# Altium schematic sheet SH1 - POWER.SchDoc: Power
size B; CheckedBy: Lance Bantoto; Engineer: Wolfgang Windholtz; Organization: UW Robotics; Address1: 200 University Avenue; Address2: Waterloo; Address3: Ontario; Address4: Canada N2L 3G6; DocumentNumber: 2; Revision: 2; SheetNumber: 1; SheetTotal: 5
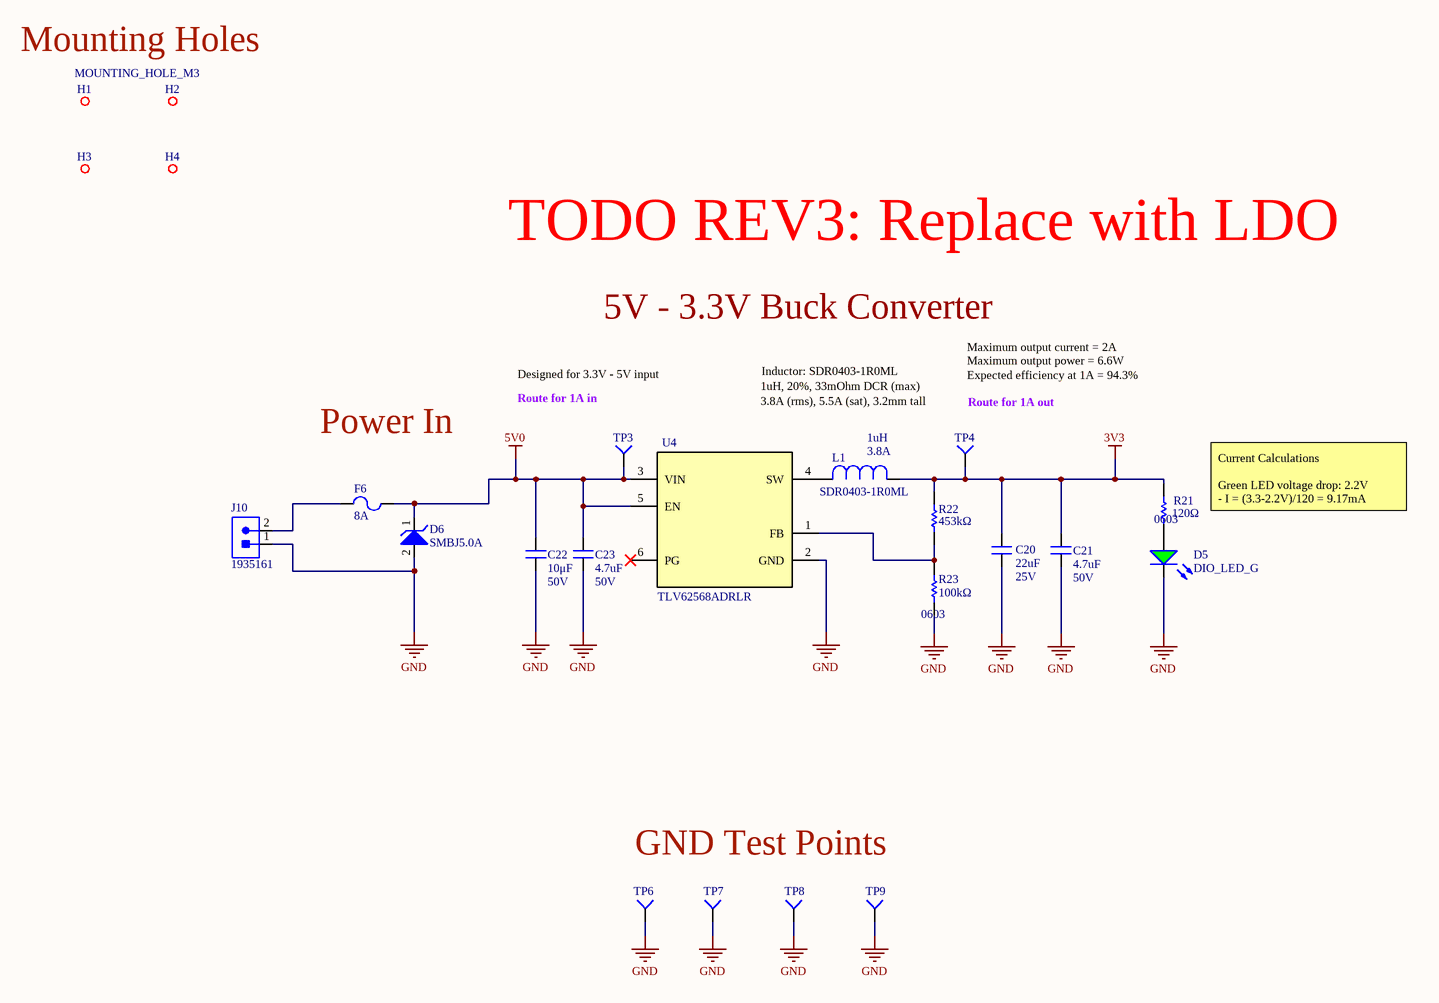
[diagram p0: SH1 - POWER.SchDoc]

## Parts
C20  Voltage: 25V  Capacitance: 22uF  [CAPC3225X270N]  (hidden comment: CAP_22uF_25V_1210)
C21  Capacitance: 4.7uF  Voltage: 50V  [CAP1206]  (hidden comment: CAP_4.7uF_50V_1206)
C22  value 10μF  Voltage Rating: 50V  [CAP1206]  (hidden comment: CAP_10uF_50V_1206)
C23  Capacitance: 4.7uF  Voltage: 50V  [CAP1206]  (hidden comment: CAP_4.7uF_50V_1206)
D5  DIO_LED_G  [LED_0805_GREEN]
D6  TVS_DIODE_UNIDIR_5V  [SMBJ5.0A]  (value not drawn)
F6  Current Rating: 8A  [FUSE_1206]  (hidden comment: FUSE_8A_1206)
H1  MOUNTING_HOLE_M3  [MOUNTING_HOLE_3mm_SCIENCE_REV2]  (no BOM)
H2  MOUNTING_HOLE_M3  [MOUNTING_HOLE_3mm_SCIENCE_REV2]  (value not drawn)  (no BOM)
H3  MOUNTING_HOLE_M3  [MOUNTING_HOLE_3mm_SCIENCE_REV2]  (value not drawn)  (no BOM)
H4  MOUNTING_HOLE_M3  [MOUNTING_HOLE_3mm_SCIENCE_REV2]  (value not drawn)  (no BOM)
J10  CON_2M_TERM  [1935161]  (value not drawn)
L1  value 1uH  Manufacturer Part Number 1: SDR0403-1R0ML  Current Rating: 3.8A  [IND_BOURNS_SDR04]  (hidden comment: IND_1uH_3.8A)
R21  value 120Ω  Package/Footprint: 0603  [RESC0603]  (hidden comment: RES_120Ω_0603)
R22  value 453kΩ  [RESC0603]  (hidden comment: RES_453kΩ_0603_1%)
R23  value 100kΩ  Package/Footprint: 0603  [RESC0603(1608)_N]  (hidden comment: RES_100kΩ_0603_1%)
TP3  TESTPOINT_SMD_LOOP  [S1751-46R]  (value not drawn)
TP4  TESTPOINT_SMD_LOOP  [S1751-46R]  (value not drawn)
TP6  TESTPOINT_SMD_LOOP  [S1751-46R]  (value not drawn)
TP7  TESTPOINT_1MM_SQUARE  [TESTPOINT_SQUARE_1MM]  (value not drawn)  (no BOM)
TP8  TESTPOINT_1MM_SQUARE  [TESTPOINT_SQUARE_1MM]  (value not drawn)  (no BOM)
TP9  TESTPOINT_1MM_SQUARE  [TESTPOINT_SQUARE_1MM]  (value not drawn)  (no BOM)
U4  TLV62568ADRLR  [SOT50P160X60-6N]

## Nets
3V3: C20.2 C21.2 L1.2 R21.2 R22.2 TP4.1(=value)
5V0: C22.2 C23.2 D6.1 F6.2 TP3.1(=value) U4.3(VIN) U4.5(EN)
GND: C20.1 C21.1 C22.1 C23.1 D5.2(K) D6.2 J10.1 R23.1 TP6.1(=value) TP7.1(=value) TP8.1(=value) TP9.1(=value) U4.2(GND)
NetD5_1: D5.1(A) R21.1
NetF6_1: F6.1 J10.2
NetL1_1: L1.1 U4.4(SW)
NetR22_1: R22.1 R23.2 U4.1(FB)

Not connected (* = marked no-connect by the designer): U4 6(PG)*

## Notes on the sheet
- Mounting Holes
- TODO REV3: Replace with LDO
- Designed for 3.3V - 5V input
- 5V - 3.3V Buck Converter
- Inductor: SDR0403-1R0ML
- Maximum output current = 2A
- Maximum output power = 6.6W
- Expected efficiency at 1A = 94.3%
- Power In
- (near TP3) Route for 1A in
- 1uH, 20%, 33mOhm DCR (max)
- 3.8A (rms), 5.5A (sat), 3.2mm tall
- (near TP4) Route for 1A out
- Current Calculations
  Green LED voltage drop: 2.2V
  - I = (3.3-2.2V)/120 = 9.17mA
- GND Test Points
- Title:
- Project:
- Date:
- Rev:
- Checker:
- Engineer:
- Sheet:
- of

## Library data of the parts
C20 = CAP_22uF_25V_1210: CAP CER 22UF 25V X7R 1210; Manufacturer 1: Murata Electronics; Manufacturer Part Number 1: GRM32ER71E226ME15K; Package/Footprint: 1210; Supplier 1: Digi-Key; Supplier Part Number 1: 490-14682-1-ND; Temperature Coefficient: X7R; Mounting Type: SMD
C21 = CAP_4.7uF_50V_1206: CAP CER 4.7UF 50V X7R 1206; Manufacturer 1: Murata; Manufacturer Part Number 1: GRM31CR71H475KA12L; Package/Footprint: 1206; Supplier 1: Digi-Key; Dielectric: X7R; Supplier Part Number 1: 490-6521-1-ND; Mounting Type: SMD
C22 = CAP_10uF_50V_1206: CAP CER 10UF 50V X5R 1206; Manufacturer Part Number 1: GRT31CR61H106KE01L; Manufacturer 1: Murata; Package/Footprint: 1206; Dimensions: 0.126" L x 0.063" W (3.20mm x 1.6mm); Package: 1206 (3216 Metric); Supplier Part Number 1: 490-12456-1-ND; Supplier 1: Digi-Key; Dielectric: X5R; Manufacturer Part Numer 1: GRT31CR61H106KE01L; Mounting Type: SMD
C23 = CAP_4.7uF_50V_1206: CAP CER 4.7UF 50V X7R 1206; Manufacturer Part Number 1: GRM31CR71H475KA12L; Manufacturer 1: Murata; Package/Footprint: 1206; Supplier Part Number 1: 490-6521-1-ND; Supplier 1: Digi-Key; Dielectric: X7R; Mounting Type: SMD
D5 = DIO_LED_G: LED GREEN DIFFUSED 0805 SMD; Manufacturer Part Number 1: LG R971-KN-1; Manufacturer 1: OSRAM; Forward Voltage Drop: 2.2V; Package/Footprint: 0805; Supplier Part Number 1: 475-1410-1-ND; Supplier 1: Digi-Key; Mounting Type: SMD
D6 = TVS_DIODE_UNIDIR_5V: TVS DIODE 5V 9.2V DO214AA; Manufacturer 1: Bourns; Max Power Dissipation: 600W; Polarity: Unidirectional; Leakage Current: 800uA; Reverse Breakdown Voltage: 6.4V; Max Surge Current: 100A; Breakdown Voltage: 7.25V; Peak Pulse Current: 65.2A; Test Current: 10mA; Number of Channels: 1; Operating Supply Voltage: 3.5V; Power Line Protection: No; Package/Footprint: SMB; Supplier 1: Digi-Key; Number of Pins: 2; Min Operating Temperature: -55°C; Max Operating Temperature: 150°C; Reverse Standoff Voltage: 5V; Min Breakdown Voltage: 6.4V; Clamping Voltage: 9.2V; Peak Pulse Power: 600W; Max Breakdown Voltage: 7.25V; Max Reverse Leakage Current: 800uA; Supplier Part Number 1: SMBJ5.0ABCT-ND; Manufacturer Part Number 1: SMBJ5.0A; Mounting Type: SMD
F6 = FUSE_8A_1206: FUSE SMD 8A 24V; Manufacturer 1: Littelfuse; Manufacturer Part Number 1: 1206SFF800F/24-2; Package/Footprint: 1206; Supplier 1: Digi-Key; Supplier Part Number 1: 1206SFF800F/24-2CT-ND; Mounting Type: SMD; LCSC Part #: C311032
H1-H4 = MOUNTING_HOLE_M3_SCIENCE_REV2: MOUNTING_HOLE_M3 Science Rev2
J10 = CON_2M_TERM: TERM BLK 2POS SIDE ENTRY 5MM; Manufacturer 1: Phoenix Contact; Max Current Rating: 16A; Current: 18A; Voltage: 300V; Package/Footprint: SMD; Supplier 1: Digi-Key; Supplier Part Number 1: 277-1667-ND; Manufacturer Part Number 1: 1935161; Mounting Type: TH
L1 = IND_1uH_3.8A: FIXED IND 1UH 3.8A 33 MOHM SMD; Manufacturer 1: Bourns Inc.; Tolerance: ±20%; Supplier Part Number 1: SDR0403-1R0MLCT-ND; Supplier 1: Digi-Key; Mounting Type: SMD; Package/Footprint: SMD
R21 = RES_120Ω_0603_5%: RES 120 OHM 5% 1/10W 0603; Manufacturer 1: Yageo; Manufacturer Part Number 1: RC0603JR-07120RL; Package: 0603 (1608 Metric); Supplier Part Number 1: 311-120GRCT-ND; Supplier 1: Digi-Key; Mounting Type: SMD
R22 = RES_453kΩ_0603_1%: RES 453K OHM 1% 1/10W 0603; Manufacturer 1: Panasonic Electronic Components; Manufacturer Part Number 1: ERJ-3EKF4533V; Package/Footprint: 0603; Package: 0603 (1608 Metric); Dimensions: 0.063" L x 0.031" W (1.60mm x 0.80mm); Supplier Part Number 1: P453KHCT-ND; Supplier 1: Digi-Key; Case Code (Metric): 1608; Tolerance: 1%; Mounting Type: SMD
R23 = RES_100kΩ_0603_1%: RES 100K OHM 1% 1/10W 0603; Manufacturer 1: Yageo; Manufacturer Part Number 1: RC0603FR-07100KL; Supplier Part Number 1: 311-100KHRCT-ND; Supplier 1: Digi-Key; Tolerance: 1%; Mounting Type: SMD
TP3 TP4 TP6 = TESTPOINT_SMD_LOOP: PC TEST POINT SMD; Manufacturer 1: Harwin; Supplier 1: Digi-Key; Manufacturer Part Number 1: S1751-46R; Supplier Part Number 1: 952-1478-1-ND; Mounting Type: SMD; Package/Footprint: SMD
TP7-TP9 = TESTPOINT_1MM_SQUARE: TESTPOINT 1MM SQUARE; Part Number (MPN): *
U4 = TLV62568ADRLR: IC REG BUCK ADJUSTABLE 2A SOT563; Manufacturer 1: Texas Instruments; Vin (Min): 2.5V; Vin (Max): 5.5V; Vout (Min/Fixed): 0.6V; Iout: 1A; Switching Frequency: 1.5MHz; Package/Footprint: SOT-563; Manufacturer Part Number 1: TLV62568ADRLR; Supplier 1: Digi-Key; Supplier Part Number 1: 296-50407-1-ND; Vout (Max): 5.5V; Iout (Max): 2A; Mounting Type: SMD